# Altium project KT0646M_Demoboard_V1.0_A.PrjPCB
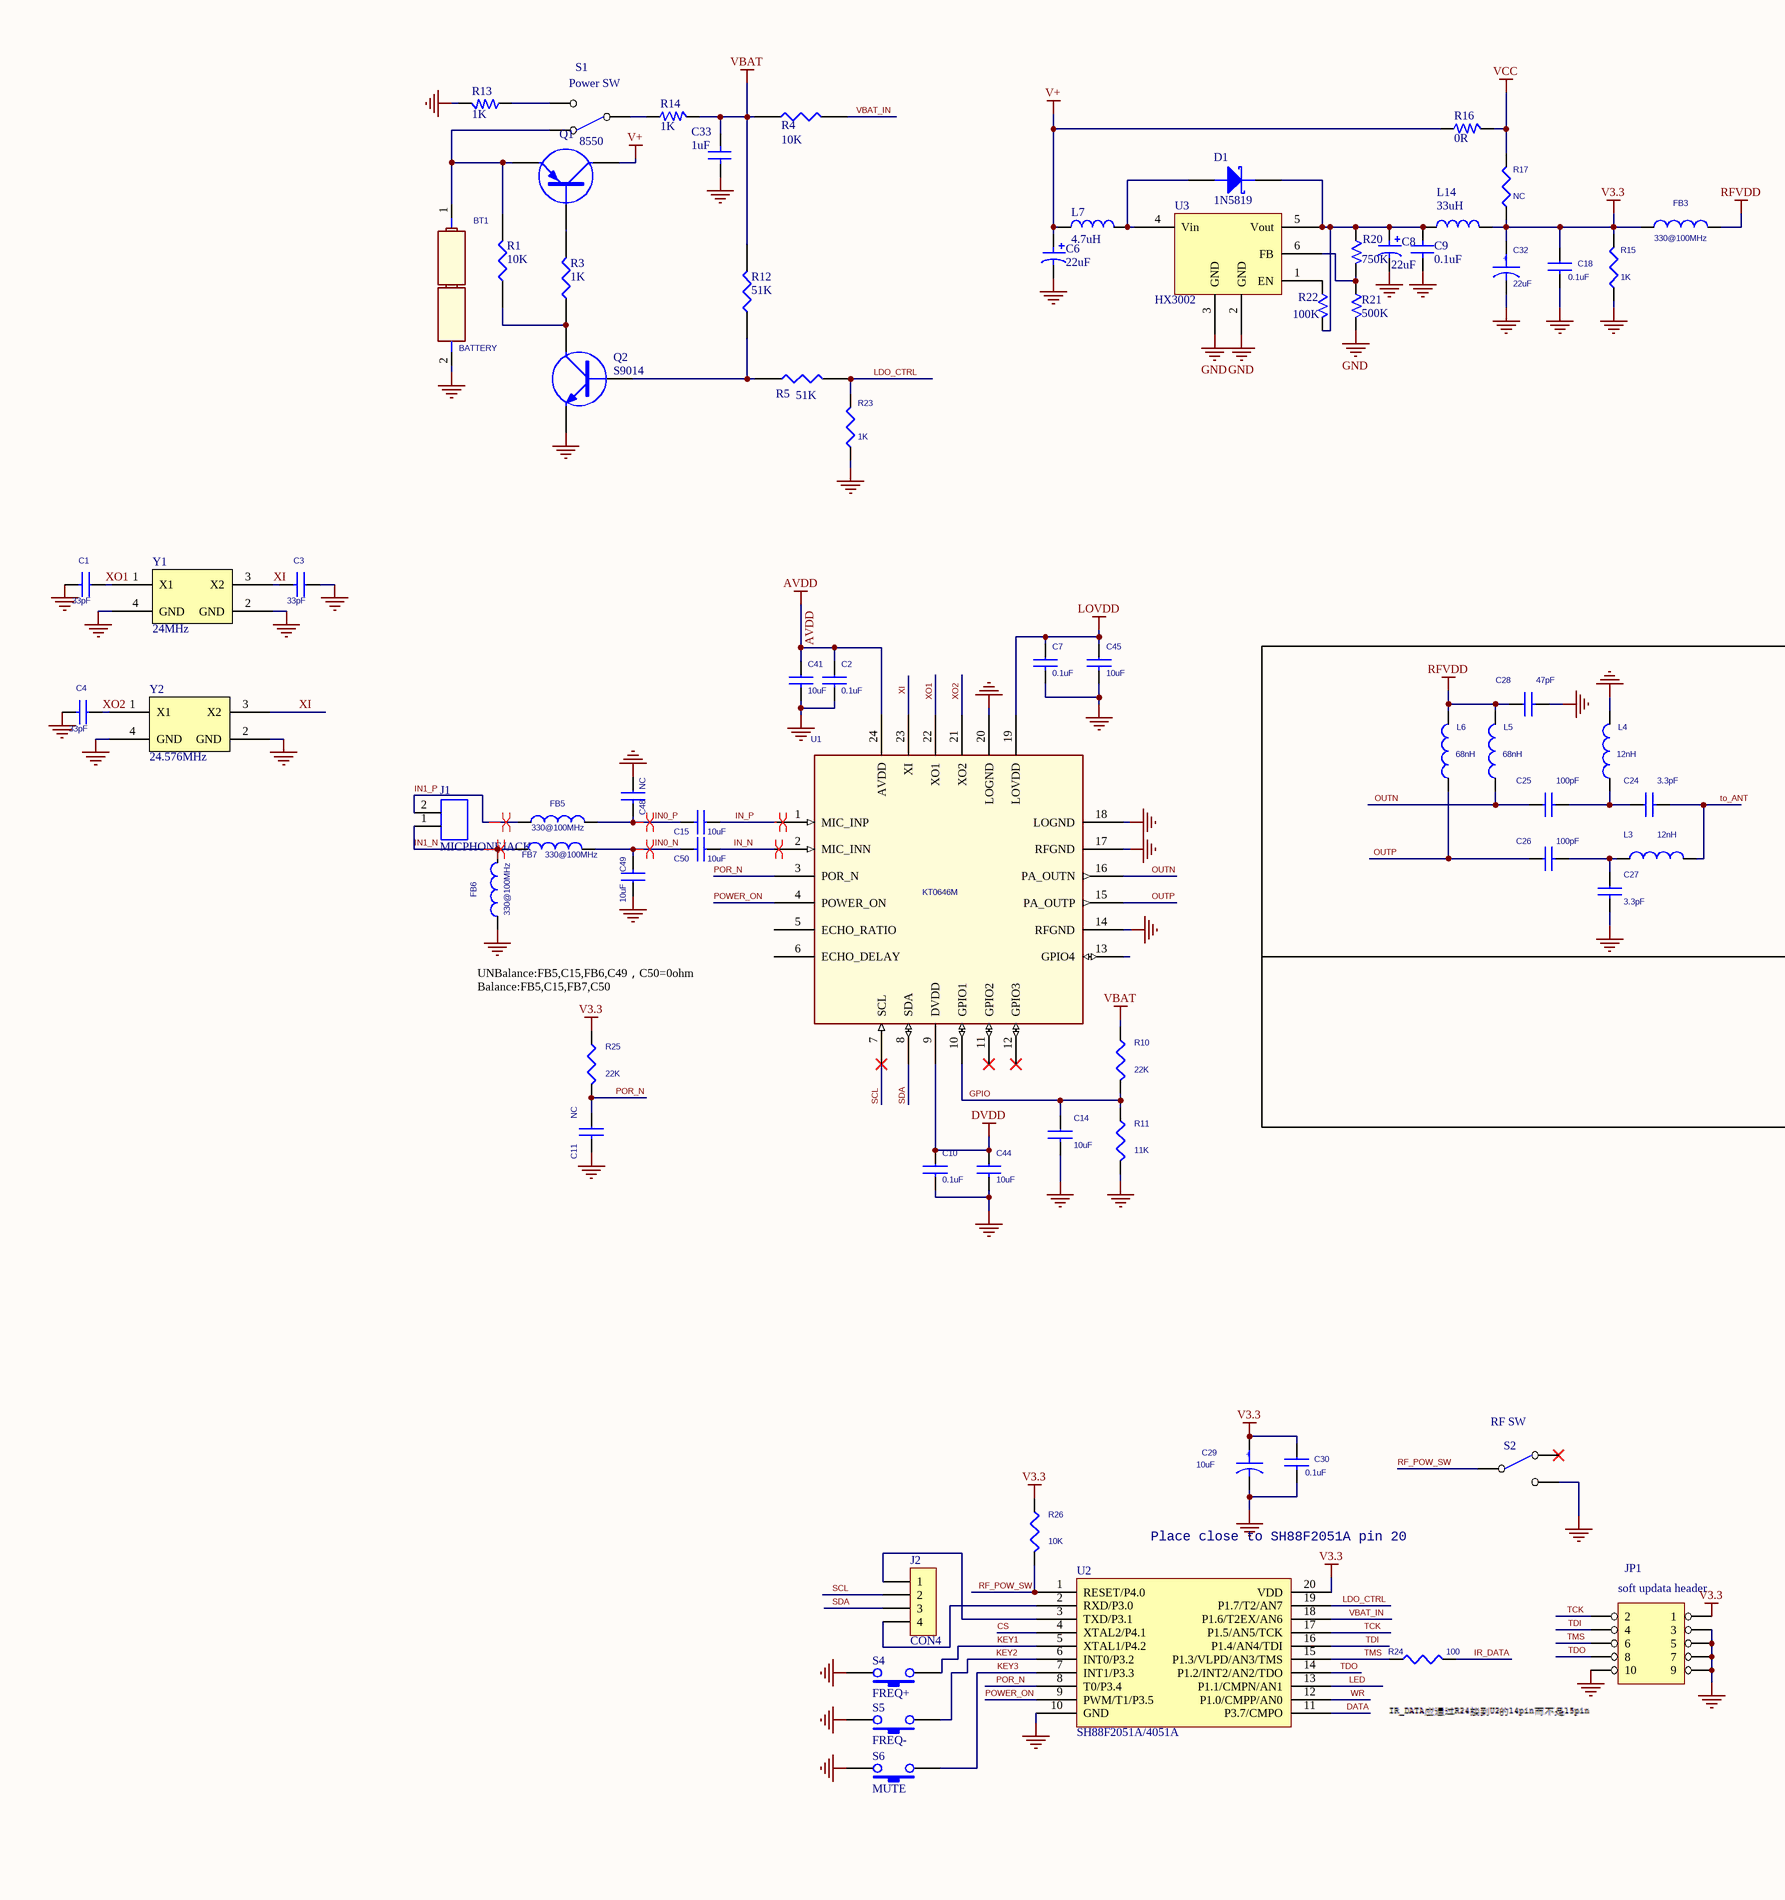
[diagram p0: KT0646M_Demoboard_V1.0.SchDoc, left]
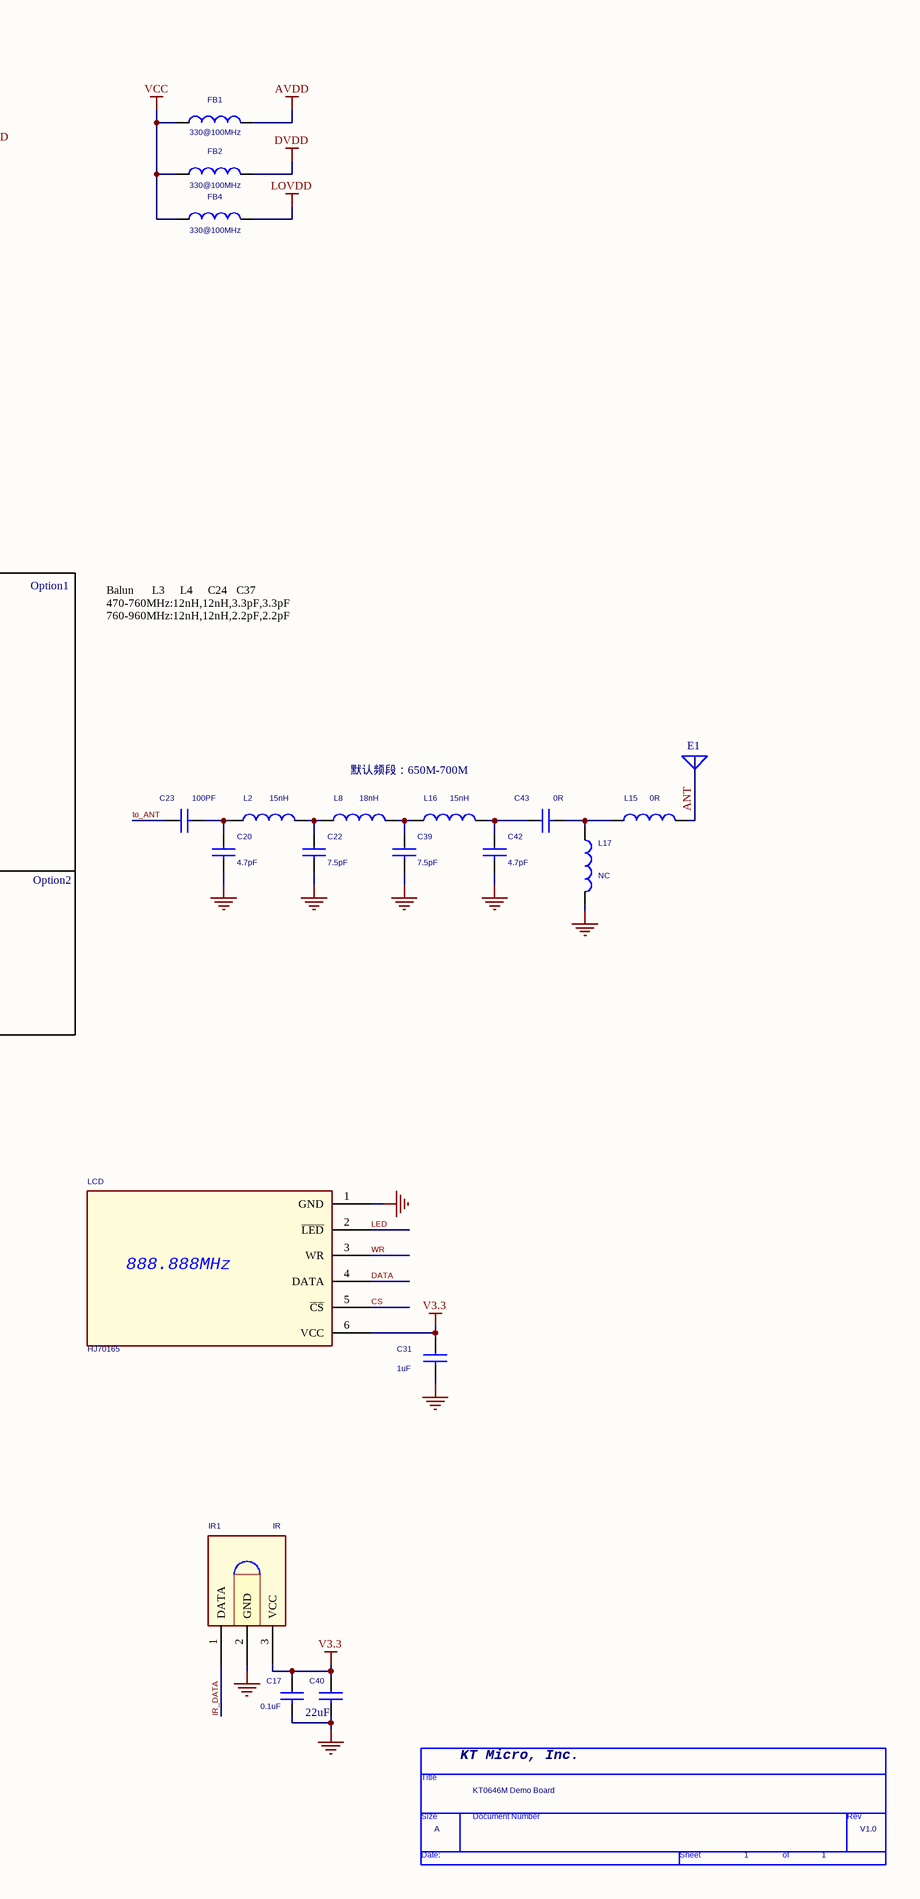
[diagram p1: KT0646M_Demoboard_V1.0.SchDoc, right]
1 sheet, 94 parts. Net scope: global (net labels, ports and power ports of the same name join across sheets).

## Sheet KT0646M_Demoboard_V1.0.SchDoc
size 513 x 386 mm

### Parts
*  RevCode: V1.0  Title: KT0646M Demo Board  Page Size: A  Page Number: 1  (hidden comment: TitleBlock0)  (graphical)
BT1  BATTERY  [BAT_new]
C1  33pF  [0603]
C2  0.1uF  [c0402]
C3  33pF  [0603]
C4  33pF  [0603]
C6  22uF  [0805]
C7  0.1uF  [0603]
C8  22uF  [0805]
C9  0.1uF  [0603]
C10  0.1uF  [0603]
C11  NC  [0603]
C14  10uF  [0603]
C15  10uF  [0603]
C17  0.1uF  [0603]
C18  0.1uF  [0603]
C20  4.7pF  [0603]
C22  7.5pF  [0603]
C23  100PF  [0603]
C24  3.3pF  [0603]
C25  100pF  [0603]
C26  100pF  [0603]
C27  3.3pF  [0603]
C28  47pF  [0603]
C29  10uF  [0603]
C30  0.1uF  [0603]
C31  1uF  [CA]
C32  22uF  [0805]
C33  1uF  [0603]
C39  7.5pF  [0603]
C40  (no value)  [0603]
C41  10uF  [C0402]
C42  4.7pF  [0603]
C43  0R  [0603]
C44  10uF  [0603]
C45  10uF  [0603]
C48  NC  [0603]
C49  10uF  [0603]
C50  10uF  [0603]
D1  1N5819  [D1206]
FB1  330@100MHz  [0603]
FB2  330@100MHz  [0603]
FB3  330@100MHz  [0603]
FB4  330@100MHz  [0603]
FB5  330@100MHz  [0603]
FB6  330@100MHz  [0603]
FB7  330@100MHz  [0603]
IR1  IR  [IRM-3638C]
J1  MICPHONEJACK  [MIC]
J2  CON4  [SIP4]
JP1  soft updata header  [HDR5X2 - change boundary]
L2  15nH  [0603]
L3  12nH  [0603]
L4  12nH  [0603]
L5  68nH  [0805L]
L6  68nH  [0805L]
L7  4.7uH  [0805LL]
L8  18nH  [0603]
L14  33uH  [805E]
L15  0R  [0603]
L16  15nH  [0603]
L17  NC  [0603]
LCD  HJ70165  [SSIP6]
Q1  8550  [SOT-23]
Q2  S9014  [SOT-23]
R1  10K  [0603]
R3  1K  [0603]
R4  10K  [0603]
R5  51K  [0603]
R10  22K  [0603]
R11  11K  [0603]
R12  51K  [0603]
R13  1K  [R0603]
R14  1K  [R0603]
R15  1K  [R0603]
R16  0R  [R0603]
R17  NC  [R0603]
R20  750K  [R0603]
R21  500K  [R0603]
R22  100K  [R0603]
R23  1K  [0603]
R24  100  [0603]
R25  22K  [0603]
R26  10K  [0603]
S1  Power SW  [SW1]
S2  RF SW  [SW1]
S4  FREQ+  [SW2]
S5  FREQ-  [SW2]
S6  MUTE  [SW2]
U1  KT0646M  [QFN24]
U2  SH88F2051A/4051A  [TSSOP-20-044-0.65]
U3  HX3002  [SOT23-6]
Y1  24MHz  [XTAL_3225]
Y2  24.576MHz  [XTAL_3225]

### Nets
AVDD: C2.1 C41.1 FB1.2 U1.24(AVDD)
DVDD: C10.1 C44.1 FB2.2 U1.9(DVDD)
GND: BT1.2(V-) C1.2 C2.2 C3.1 C4.2 C6.2 C7.2 C8.2 C9.1 C10.2 C11.2 C14.2 C17.2 C18.2 C20.2 C22.2 C27.2 C28.2 C29.2 C30.2 C31.2 C32.2 C33.1 C39.2 C40.2 C41.2 C42.2 C44.2 C45.2 C48.1 C49.1 FB6.1 IR1.2(GND) JP1.3 JP1.5 JP1.7 JP1.9 JP1.10 L4.2 L17.2 LCD.1(GND) Q2.2(E) R11.2 R13.2 R15.2 R21.2 R23.2 S2.3(NO) S4.2 S5.2 S6.2 U1.14(RFGND) U1.17(RFGND) U1.18(LOGND) U1.20(LOGND) U1.25(GND) U2.10(GND) U3.2(GND) U3.3(GND) Y1.2(GND) Y1.4(GND) Y2.2(GND) Y2.4(GND)
LOVDD: C7.1 C45.1 FB4.2 U1.19(LOVDD)
RFVDD: C28.1 FB3.2 L5.2 L6.2
V3.3: C17.1 C18.1 C29.1 C30.1 C31.1 C32.1 C40.1 FB3.1 IR1.3(VCC) JP1.1 L14.2 LCD.6(VCC) R15.1 R17.2 R25.1 R26.1 U2.20(VDD)
V+: C6.1 L7.1 Q1.3(C) R16.1
VBAT: C33.2 R4.1 R10.1 R12.2 R14.2
VCC: FB1.1 FB2.1 FB4.1 R16.2 R17.1
ANT: L15.2
CS: LCD.5(~{CS}) U2.4(XTAL2/P4.1)
DATA: LCD.4(DATA) U2.11(P3.7/CMPO)
GPIO: C14.1 R10.2 R11.1 U1.10(GPIO1)
IN0_N: C49.2 C50.2 FB7.2
IN0_P: C15.2 C48.2 FB5.2
IN1_N: FB6.2 FB7.1 J1.1
IN1_P: FB5.1 J1.2
IN_N: C50.1 U1.2(MIC_INN)
IN_P: C15.1 U1.1(MIC_INP)
IR_DATA: IR1.1(DATA) R24.2
KEY1: S4.1 U2.5(XTAL1/P4.2)
KEY2: S5.1 U2.6(INT0/P3.2)
KEY3: S6.1 U2.7(INT1/P3.3)
LDO_CTRL: R5.2 R23.1 U2.19(P1.7/T2/AN7)
LED: LCD.2(~{LED}) U2.13(P1.1/CMPN/AN1)
OUTN: C25.1 L5.1 U1.16(PA_OUTN)
OUTP: C26.1 L6.1 U1.15(PA_OUTP)
POR_N: C11.1 R25.2 U1.3(POR_N) U2.8(T0/P3.4)
POWER_ON: U1.4(POWER_ON) U2.9(PWM/T1/P3.5)
RF_POW_SW: R26.2 S2.1(COMMON) U2.1(RESET/P4.0)
SCL: J2.2 U1.7(SCL)
SDA: J2.3 U1.8(SDA)
TCK: JP1.2 U2.17(P1.5/AN5/TCK)
TDI: JP1.4 U2.16(P1.4/AN4/TDI)
TDO: JP1.8 U2.14(P1.2/INT2/AN2/TDO)
TMS: JP1.6 R24.1 U2.15(P1.3/VLPD/AN3/TMS)
to_ANT: C23.1 C24.2 L3.2
VBAT_IN: R4.2 U2.18(P1.6/T2EX/AN6)
WR: LCD.3(WR) U2.12(P1.0/CMPP/AN0)
XI: C3.2 U1.23(XI) Y1.3(X2) Y2.3(X2)
XO1: C1.1 U1.22(XO1) Y1.1(X1)
XO2: C4.1 U1.21(XO2) Y2.1(X1)
NetBT1_1: BT1.1(V+) Q1.2(E) R1.2 S1.2(NC)
NetC8_1: C8.1 C9.2 D1.2(K) L14.1 R20.1 R22.2 U3.5(Vout)
NetC20_1: C20.1 C23.2 L2.1
NetC22_1: C22.1 L2.2 L8.1
NetC24_1: C24.1 C25.2 L4.1
NetC26_2: C26.2 C27.1 L3.1
NetC39_1: C39.1 L8.2 L16.1
NetC42_1: C42.1 C43.1 L16.2
NetC43_2: C43.2 L15.1 L17.1
NetD1_1: D1.1(A) L7.2 U3.4(Vin)
NetJ2_1: J2.1 U2.3(TXD/P3.1)
NetJ2_4: J2.4 U2.2(RXD/P3.0)
NetQ1_1: Q1.1(B) R3.2
NetQ2_1: Q2.1(B) R5.1 R12.1
NetQ2_3: Q2.3(C) R1.1 R3.1
NetR13_1: R13.1 S1.3(NO)
NetR14_1: R14.1 S1.1(COMMON)
NetR20_2: R20.2 R21.1 U3.6(FB)
NetR22_1: R22.1 U3.1(EN)

Not connected (* = marked no-connect by the designer): S2 2(NC)*; U1 5(ECHO_RATIO) 6(ECHO_DELAY) 11(GPIO2)* 12(GPIO3)* 13(GPIO4)

### Layout directives
differential pair: IN0_N, IN0_P, IN1_N, IN1_P, IN_N, IN_P

### Notes on the sheet
- Option1
- Balun	     L3     L4     C24   C37
  470-760MHz:12nH,12nH,3.3pF,3.3pF
  760-960MHz:12nH,12nH,2.2pF,2.2pF
- 默认频段：650M-700M
- E1
- UNBalance:FB5,C15,FB6,C49，C50=0ohm
  Balance:FB5,C15,FB7,C50
- Option2
- Place close to SH88F2051A pin 20
- (near *) KT Micro, Inc.
- (in symbol CAP NP) 22uF
- (in symbol CAP POL) +
- (in symbol HJ70165) 888.888MHz
- (in symbol TitleBlock0) Title; Size; Document Number; Rev; Date:; Sheet; of

### Library data of the parts
BT1 = BATTERY_2
C1-C4 C7 C10 C11 C14 C15 C17 C18 C20 C22-C28 C30 C31 C39-C45 C48-C50 = CAP NP
C6 C8 = CAP
C9 C33 = C
C29 C32 = CAP POL
D1 = DIODE SCHOTTKY: Schottky Diode
FB1-FB7 L2-L6 L8 L15-L17 = INDUCTOR
J1 = MICPHONE-0605
J2 = CON4: Connector
JP1 = HEADER 5X2
L7 L14 = L
Q1 = S8550
R1 R3-R5 R12 = RES1
R10 R11 R15 R17 R23-R26 = RESISTOR
R13 R14 R16 R20-R22 = R
S1 S2 = SW SPDT
S4-S6 = SW-PB
Y1 Y2 = XTAL_1
* = TitleBlock0: Page Create Date: March  8, 1995; Page Count: 1